# Altium schematic sheet Power_board_2.SchDoc
size A4; SheetNumber: 2; SheetTotal: 2
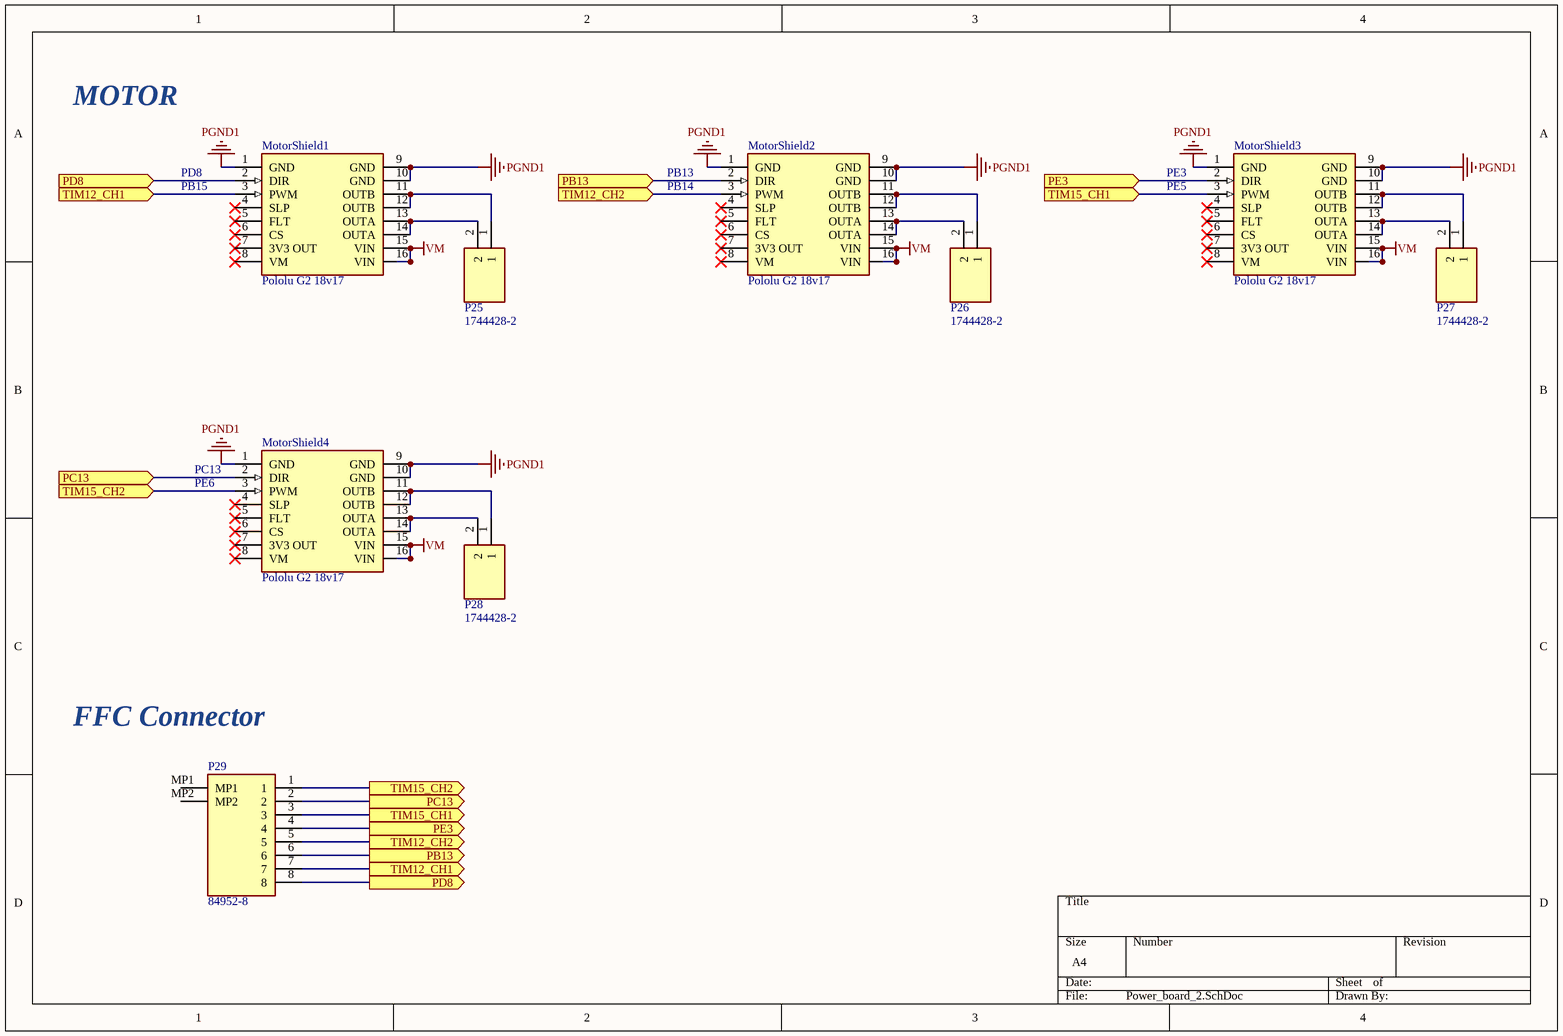
[diagram p0: Power_board_2.SchDoc]

## Parts
MotorShield1  Pololu G2 18v17  [Pololu G218V17]
MotorShield2  Pololu G2 18v17  [Pololu G218V17]
MotorShield3  Pololu G2 18v17  [Pololu G218V17]
MotorShield4  Pololu G2 18v17  [Pololu G218V17]
P25  1744428-2  [17444282]
P26  1744428-2  [17444282]
P27  1744428-2  [17444282]
P28  1744428-2  [17444282]
P29  84952-8  [849528]

## Ports
PB13 (in, see Power_board_2[1D]), PB13 (out, see Power_board_2[2A]), PC13 (in, see Power_board_2[1D]), PC13 (out, see Power_board_2[1B]), PD8 (in, see Power_board_2[1D]), PD8 (out, see Power_board_2[1A]), PE3 (in, see Power_board_2[1D]), PE3 (out, see Power_board_2[3A]), TIM12_CH1 (in, see Power_board_2[1D]), TIM12_CH1 (out, see Power_board_2[1A]), TIM12_CH2 (in, see Power_board_2[1D]), TIM12_CH2 (out, see Power_board_2[2A]), TIM15_CH1 (in, see Power_board_2[1D]), TIM15_CH1 (out, see Power_board_2[3A]), TIM15_CH2 (in, see Power_board_2[1D]), TIM15_CH2 (out, see Power_board_2[1B])

## Nets
PGND1: MotorShield1.1(GND) MotorShield1.9(GND) MotorShield1.10(GND) MotorShield2.1(GND) MotorShield2.9(GND) MotorShield2.10(GND) MotorShield3.1(GND) MotorShield3.9(GND) MotorShield3.10(GND) MotorShield4.1(GND) MotorShield4.9(GND) MotorShield4.10(GND)
VM: MotorShield1.15(VIN) MotorShield1.16(VIN) MotorShield2.15(VIN) MotorShield2.16(VIN) MotorShield3.15(VIN) MotorShield3.16(VIN) MotorShield4.15(VIN) MotorShield4.16(VIN)
PB13: MotorShield2.2(DIR) P29.6 ; port PB13
PC13: MotorShield4.2(DIR) P29.2 ; port PC13
PD8: MotorShield1.2(DIR) P29.8 ; port PD8
PE3: MotorShield3.2(DIR) P29.4 ; port PE3
TIM12_CH1: MotorShield1.3(PWM) P29.7 ; port TIM12_CH1
TIM12_CH2: MotorShield2.3(PWM) P29.5 ; port TIM12_CH2
TIM15_CH1: MotorShield3.3(PWM) P29.3 ; port TIM15_CH1
TIM15_CH2: MotorShield4.3(PWM) P29.1 ; port TIM15_CH2
NetMotorShield1_11: MotorShield1.11(OUTB) MotorShield1.12(OUTB) P25.1
NetMotorShield1_13: MotorShield1.13(OUTA) MotorShield1.14(OUTA) P25.2
NetMotorShield2_11: MotorShield2.11(OUTB) MotorShield2.12(OUTB) P26.1
NetMotorShield2_13: MotorShield2.13(OUTA) MotorShield2.14(OUTA) P26.2
NetMotorShield3_11: MotorShield3.11(OUTB) MotorShield3.12(OUTB) P27.1
NetMotorShield3_13: MotorShield3.13(OUTA) MotorShield3.14(OUTA) P27.2
NetMotorShield4_11: MotorShield4.11(OUTB) MotorShield4.12(OUTB) P28.1
NetMotorShield4_13: MotorShield4.13(OUTA) MotorShield4.14(OUTA) P28.2

Not connected (* = marked no-connect by the designer): MotorShield1 4(SLP)* 5(FLT)* 6(CS)* 7(3V3_OUT)* 8(VM)*; MotorShield2 4(SLP)* 5(FLT)* 6(CS)* 7(3V3_OUT)* 8(VM)*; MotorShield3 4(SLP)* 5(FLT)* 6(CS)* 7(3V3_OUT)* 8(VM)*; MotorShield4 4(SLP)* 5(FLT)* 6(CS)* 7(3V3_OUT)* 8(VM)*; P29 MP1 MP2

## Notes on the sheet
- MOTOR
- PD8
- PB13
- (near MotorShield3) PE3
- PB15
- PB14
- (near MotorShield3) PE5
- (near MotorShield4) PE6
- (near MotorShield4) PC13
- FFC Connector

## Library data of the parts
MotorShield1-MotorShield4 = Pololu G2 18v17: DC Motor Driver
P25-P28 = 1744428-2: Connector; Manufacturer_Name: TE Connectivity; Datasheet Link: https://www.te.com/commerce/DocumentDelivery/DDEController?Action=srchrtrv&DocNm=1744428&DocType=Customer+Drawing&DocLang=English; Height: 8.8mm; Manufacturer_Part_Number: 1744428-2; Mouser Part Number: 571-1744428-2; Mouser Price/Stock: https://www.mouser.co.uk/ProductDetail/TE-Connectivity/1744428-2?qs=%2F6W%2F9%2FHWvcDoOfykajFB2Q%3D%3D
P29 = 84952-8: Connector; Manufacturer_Name: TE Connectivity; Datasheet Link: https://www.te.com/commerce/DocumentDelivery/DDEController?Action=showdoc&DocId=Customer+Drawing%7F84952%7FA4%7Fpdf%7FEnglish%7FENG_CD_84952_A4.pdf%7F84952-8; Height: 2.74mm; Manufacturer_Part_Number: 84952-8; Mouser Part Number: 571-84952-8; Mouser Price/Stock: https://www.mouser.co.uk/ProductDetail/TE-Connectivity/84952-8?qs=uUkeXfjQ8uTKEYAHE0dNDQ%3D%3D; Arrow Part Number: 84952-8; Arrow Price/Stock: https://www.arrow.com/en/products/84952-8/te-connectivity?region=europe